# EAGLE design attiny85_pogo_pgm (EAGLE 6.2)
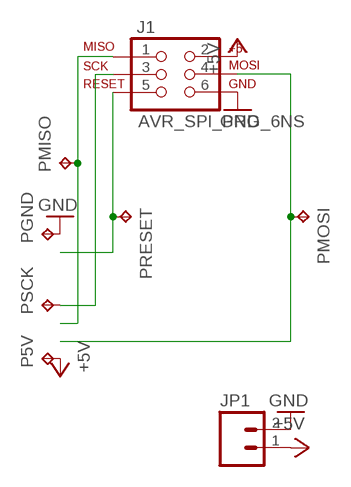
[diagram p0: schematic, sheet 1]

## Parts
J1  AVR_SPI_PRG_6NS  [2X3-NS]
JP1  M02PTH  [1X02]
P5V  TPTP12R  [TP12R]
PGND  TPTP12R  [TP12R]
PMISO  TPTP12R  [TP12R]
PMOSI  TPTP12R  [TP12R]
PRESET  TPTP12R  [TP12R]
PSCK  TPTP12R  [TP12R]

## Nets
+5V: J1.2 JP1.1 P5V.TP
GND: J1.6 JP1.2 PGND.TP
IN1/MISO: J1.1 PMISO.TP
RESET-: J1.5 PRESET.TP
SCL/SCK: J1.3 PSCK.TP
SDA/MOSI: J1.4 PMOSI.TP

## Library data of the parts
J1 = SparkFun-Connectors:AVR_SPI_PRG_6: AVR ISP 6 Pin This is the reduced ISP connector for AVR programming. Common on Arduino. This footprint will take up less PCB space and can be used with a 10-pin to 6-pin adapter such as SKU: BOB-08508
JP1 = SparkFun-Connectors:M02: Header 2 Standard 2-pin 0.1" header. Use with straight break away headers (SKU : PRT-00116), right angle break away headers (PRT-00553), swiss pins (PRT-00743), machine pins (PRT-00117), and female headers (PRT-00115). Molex polarized connector foot print use with SKU : PRT-08233 with associated crimp pins and housings.
P5V PGND PMISO PMOSI PRESET PSCK = testpad:TP: Test pad

## Board
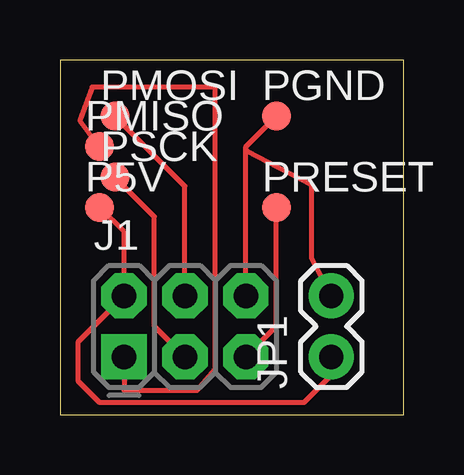
[diagram p1: board, top side]

Size 14.33 x 14.78 mm. Coordinates in mm from the lower left corner, seen from the top.
Outline: 0,0 14.33,0 14.33,14.78 0,14.78 0,0
Copper layers 1: Top 0.035mm
Design rules: minimum track width 8mil, minimum drill 24mil, track to track 8mil, track to pad 8mil, pad to pad 8mil, via to via 8mil, smd to smd 8mil, copper to edge 40mil, drill to drill 8mil, minimum pad ring 10mil, minimum via ring 8mil, stop-mask expansion 4mil, vias tented up to drill 0mil, thermal gap 10mil

### Footprints (pad centres in the part's own frame; a part is rotated, then mirrored left to right if it is on the bottom)
2X3-NS = drill 1.016 pad 1.88 square: 1 -2.54,-1.27 | drill 1.016 pad 1.88 octagon: 2 -2.54,1.27; 3 0,-1.27; 4 0,1.27; 5 2.54,-1.27; 6 2.54,1.27
1X02 = drill 1.016 pad 1.88: 1 0,0; 2 2.54,0
TP12R = smd 1.2 x 1.2: TP 0,0

### Placement (x,y rotation side)
J1  5.21,3.68 0 top
JP1  11.3,2.41 90 top
P5V  1.65,8.64 0 top
PGND  9.02,12.45 0 top
PMISO  1.65,11.18 0 top
PMOSI  2.29,12.45 0 top
PRESET  9.02,8.64 0 top
PSCK  2.29,9.91 0 top

### Tracks (layer width: path | path; a pad name or v marks a point on that pad's centre or on a via)
+5V
  Top 0.203: P5V.TP 2.67,7.62 J1.2 0.76,3.05 0.76,1.4 1.65,0.51 10.16,0.51 11.3,1.65 JP1.1
GND
  Top 0.203: PGND.TP 7.75,11.18 7.75,10.99 | J1.6 7.75,10.99 | JP1.2 10.48,6.54 10.48,9.59 7.81,10.99 7.75,10.99
IN1/MISO
  Top 0.203: PMISO.TP 1.46,11.37 0.83,12.26 1.33,13.65 6.48,13.65 6.48,1.91 5.71,1.02 2.67,1.02 J1.1
RESET-
  Top 0.203: PRESET.TP 9.02,3.68 J1.5
SCL/SCK
  Top 0.203: PSCK.TP 3.94,8.26 3.94,3.68 J1.3
SDA/MOSI
  Top 0.203: PMOSI.TP 5.21,9.53 J1.4